# EAGLE design phi-brain4ch-ctrl (EAGLE 7.3.0)
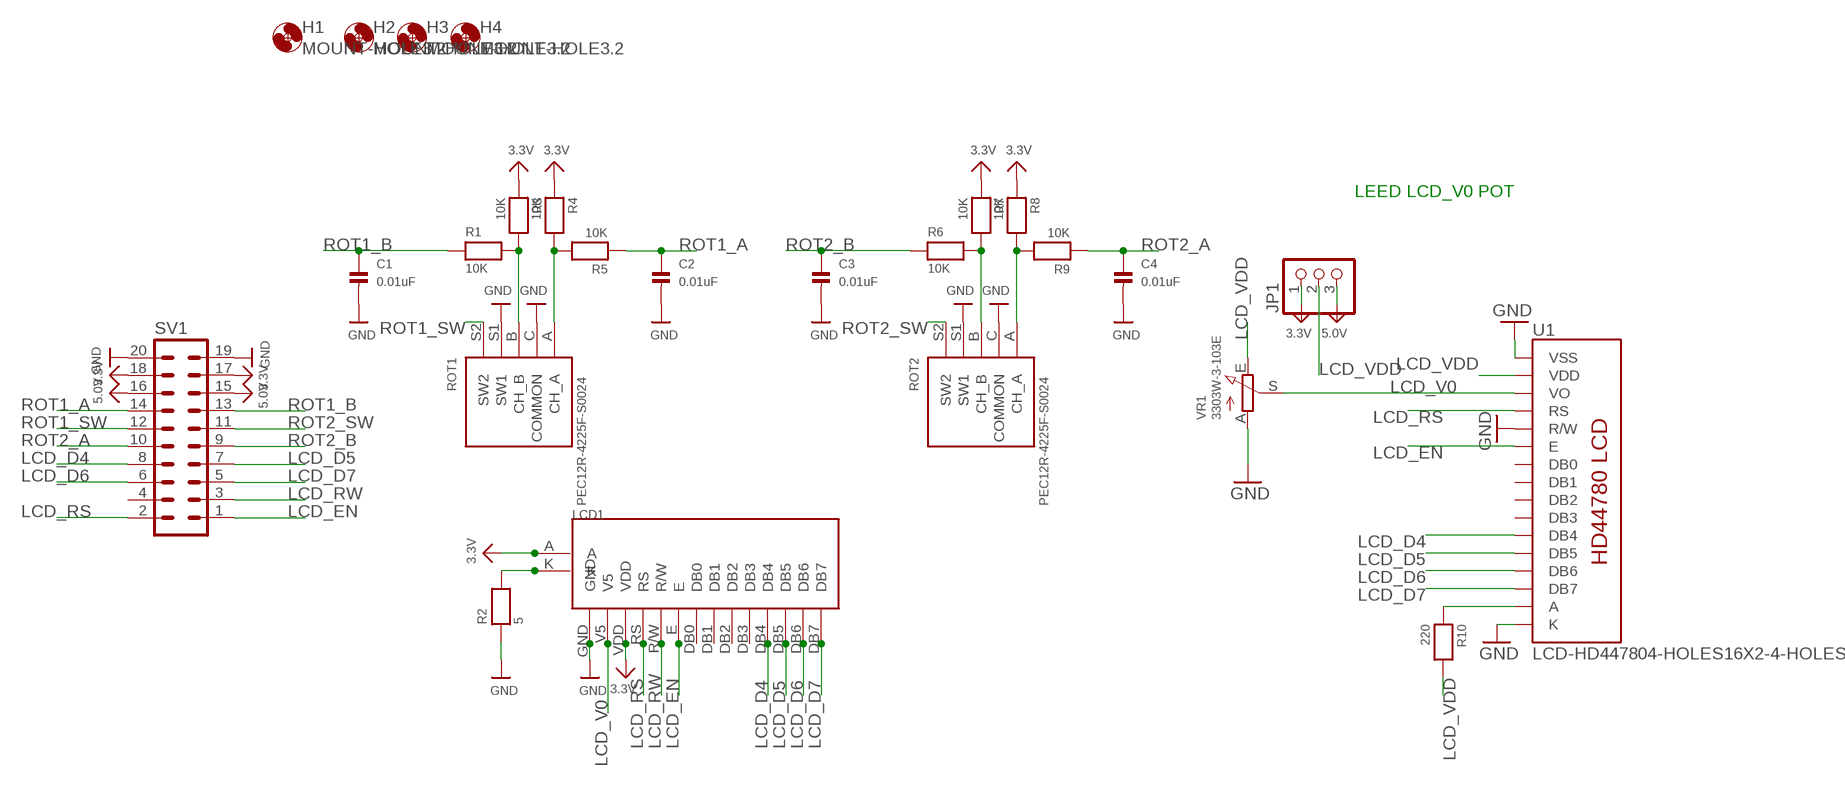
[diagram p0: schematic, sheet 1]

## Parts
C1  0.01uF  CAP_CERAMIC0805  [0805]
C2  0.01uF  CAP_CERAMIC0805  [0805]
C3  0.01uF  CAP_CERAMIC0805  [0805]
C4  0.01uF  CAP_CERAMIC0805  [0805]
H1  MOUNT-HOLE3.2  [3,2]
H2  MOUNT-HOLE3.2  [3,2]
H3  MOUNT-HOLE3.2  [3,2]
H4  MOUNT-HOLE3.2  [3,2]
JP1  PINHD-1X3  [1X03]
LCD1  NHD-C0220AA-FSW-FTW  [NHD-C0220AA-FSW-FTW]
R1  10K  RESISTOR_0805  [_0805]
R2  5  RESISTOR_0805  [_0805]
R3  10K  RESISTOR_0805  [_0805]
R4  10K  RESISTOR_0805  [_0805]
R5  10K  RESISTOR_0805  [_0805]
R6  10K  RESISTOR_0805  [_0805]
R7  10K  RESISTOR_0805  [_0805]
R8  10K  RESISTOR_0805  [_0805]
R9  10K  RESISTOR_0805  [_0805]
R10  220  RESISTOR_0805  [_0805]
ROT1  PEC12R-4225F-S0024  PEC11-4215K-S0024  [PEC111-4XXXK-SXXXX]
ROT2  PEC12R-4225F-S0024  PEC11-4215K-S0024  [PEC111-4XXXK-SXXXX]
SV1  ML203MSMT  [ML20SMT]
U1  LCD-HD447804-HOLES16X2-4-HOLES  [LCD-16X2-4HOLES]
VR1  3303W-3-103E  TRIMPOT10K_BOURNS  [TRIMPOT_BOURNS3MM]

## Nets
3.3V: JP1.1 LCD1.A LCD1.VDD R3.1 R4.1 R7.1 R8.1 SV1.17 SV1.18
5.0V: JP1.3 SV1.15 SV1.16
GND: C1.2 C2.2 C3.2 C4.2 LCD1.GND R2.1 ROT1.C(COMMON) ROT1.S1(SW1) ROT2.C(COMMON) ROT2.S1(SW1) SV1.19 SV1.20 U1.1(VSS) U1.5(R/W) U1.16(K) VR1.A
LCD_D4: LCD1.DB4 SV1.8 U1.11(DB4)
LCD_D5: LCD1.DB5 SV1.7 U1.12(DB5)
LCD_D6: LCD1.DB6 SV1.6 U1.13(DB6)
LCD_D7: LCD1.DB7 SV1.5 U1.14(DB7)
LCD_EN: LCD1.E SV1.1 U1.6(E)
LCD_RS: LCD1.RS SV1.2 U1.4(RS)
LCD_RW: LCD1.R/W SV1.3
LCD_V0: LCD1.V5 U1.3(VO) VR1.S
LCD_VDD: JP1.2 R10.2 U1.2(VDD) VR1.E
N$1: LCD1.K R2.2
N$6: R10.1 U1.15(A)
N$10: R6.2 R7.2 ROT2.B(CH_B)
N$11: R8.2 R9.2 ROT2.A(CH_A)
N$14: R1.2 R3.2 ROT1.B(CH_B)
N$15: R4.2 R5.2 ROT1.A(CH_A)
ROT1_A: C2.1 R5.1 SV1.14
ROT1_B: C1.1 R1.1 SV1.13
ROT1_SW: ROT1.S2(SW2) SV1.12
ROT2_A: C4.1 R9.1 SV1.10
ROT2_B: C3.1 R6.1 SV1.9
ROT2_SW: ROT2.S2(SW2) SV1.11
Unconnected: LCD1.DB0 LCD1.DB1 LCD1.DB2 LCD1.DB3 SV1.4 U1.7(DB0) U1.8(DB1) U1.9(DB2) U1.10(DB3)

## Notes on the sheet
- LEED LCD_V0 POT

## Library data of the parts
C1-C4 = microbuilder:CAP_CERAMIC: Ceramic Capacitors 0402 - 0402 Surface Mount Capacitors 16pF 50V 5% [Digikey: 445-4899-2-ND] 18pF 50V 5% [Digikey: 490-1281-2-ND] 22pF 50V 5% [Digikey: 490-1283-2-ND] 68pF 50V 5% [Digikey: 490-1289-2-ND] 0.1uF 10V 10% [Digikey: 490-1318-2-ND] 1.0uF 6.3V 10% [Digikey: 490-1320-2-ND] 0603 - 0603 Surface Mount Capacitors 16 pF 50V 5% [Digikey: 445-5051-2-ND] 22 pF 50V [Digikey: PCC220ACVTR-ND] 33 pF 50V 5% [Digikey: 490-1415-1-ND] 56pF 50V 5% [Digikey: 490-1421-1-ND] 220pF 50V 5% [Digikey: 445-1285-1-ND] 680 pF 50V 2200 pF 50V 5% C0G [Digikey: 445-1297-1-ND] 5600 pF 100V 5% X7R [Digikey: 478-3711-1-ND] 0.1 µF 25V 10% [Digikey: PCC2277TR-ND] 0.22 µF 16V 10% X7R [Digikey: 445-1318-1-ND] 1.0 µF 25V 10% [Digikey: 445-5146-2-ND] 0603 - RF Specific 3pF 250V +/-0.1pF RF [Digikey: 712-1347-1-ND] 18 pF 250V 5% [Digikey: 478-3505-1-ND or 712-1322-1-ND] 56 pF 250V 5% C0G RF [Digikey: 490-4867-1-ND] 68 pF 250V RF [Digikey: 490-4868-1-ND] 0805 - 0805 Surface Mount Capacitors 220 pF 250V 2% RF Ceramic Capacitor [Digikey: 712-1398-1-ND] 1000 pF 50V 2% NP0 Ceramic Capacitor [Digikey: 478-3760-1-ND] 0.1 µF 25V 10% Ceramic Capacitor [Digikey: PCC1828TR-ND] 1.0 µF 16V 10% Ceramic Capacitor[Digikey: 490-1691-2-ND] 10.0 µF 10V 10% Ceramic Capacitor[Digikey: 709-1228-1-ND] 10.0 uF 16V 10% Ceramic Capacitor [Digikey: 478-5165-2-ND] 47 uF 6.3V 20% Ceramic Capacitor [Digikey: 587-1779-1-ND or 399-5506-1-ND] 1206 - 1206 Surface Mount Capacitors 47uF 10V 20% Ceramic Capacitor [Digikey: 490-5528-1-ND or 399-5508-1-ND or 445-6010-1-ND] 100uF 6.3V -20%, +80% Y5V Ceramic Capacitor (Digikey: 490-4512-1-ND, Mouser: 81-GRM31CF50J107ZE1L)
H1-H4 = holes:MOUNT-HOLE: MOUNTING HOLE with drill center marker; POPULATE: 0
JP1 = pinhead+:PINHD-1X3: PIN HEADER
LCD1 = NHD-C0220AA-FSW-FTW:NHD-C0220AA-FSW-FTW: NHD-C0220AA-FSW-FTW http://www.newhavendisplay.com/specs/NHD-C0220AA-FSW-FTW.pdf COG (Chip-on-Glass) Liquid Crystal Display Module NHD Newhaven Display C0220 COG, 2 lines x 20 characters AA Model F Transflective SW Side White LED backlight F FSTN+ T 12:00 View Angle W Wide Temp (‐20°C ~ +70°C) RoHS Compliant www.newhavendisplay.com
R1-R10 = microbuilder:RESISTOR: Resistors 0402 - 0402 Surface Mount Package 22 Ohm 1% 1/16W [Digikey: 311-22.0LRTR-ND] 33 Ohm 5% 1/16W 1.0K 5% 1/16W 1.5K 5% 1/16W 2.0K 1% 1/16W 10.0K 1% 1/16W [Digikey: 311-10.0KLRTR-ND] 10.0K 5% 1/16W [Digikey: RMCF0402JT10K0TR-ND] 12.1K 1% 1/16W [Digikey: 311-22.0LRTR-ND] 100.0K 5% 1/16W 0603 - 0603 Surface Mount Package 0 Ohm 1/10 Watt 1% Resistor 15 Ohm 1/10 Watt 1% Resistor 33 Ohm 1/10 Watt 1% Resistor 49.9 Ohm 1/10 Watt 1% Resistor 100 Ohm 1/10 Watt 1% Resistor 150 Ohm 1/10 Watt 1% Resistor 240 Ohm 1/10 Watt 1% Resistor 390 Ohm 1/10 Watt 1% Resistor 560 Ohm 1/10 Watt 1% Resistor 680 Ohm 1/10 Watt 1% Resistor 750 Ohm 1/10 Watt 1% Resistor 1.0K Ohm 1/10 Watt 1% Resistor 1.5K Ohm 1/10 Watt 1% Resistor 2.0K Ohm 1/10 Watt 1% Resistor 2.2K Ohm 1/10 Watt 1% Resistor 3.3K Ohm 1/10 Watt 1% Resistor 4.7K Ohm 1/10 Watt 1% Resistor 10.0K Ohm 1/10 Watt 1% Resistor 12.0K Ohm 1/10 Watt 1% Resistor 12.1K Ohm 1/10 Watt 1% Resistor 20.0K Ohm 1/10 Watt 1% Resistor 33.0K Ohm 1/10 Watt 1% Resistor 100.0K Ohm 1/10 Watt 1% Resistor 0805 - 0805 Surface Mount Package 0 Ohm 1/8 Watt 1% Resistor 33 Ohm 1/8 Watt 1% Resistor 100 Ohm 1/8 Watt 1% Resistor 150 Ohm 1/8 Watt 1% Resistor 200 Ohm 1/8 Watt 1% Resistor 240 Ohm 1/8 Watt 1% Resistor 330 Ohm 1/8 Watt 1% Resistor 390 Ohm 1/8 Watt 1% Resistor 470 Ohm 1/8 Watt 1% Resistor 1.0K Ohm 1/8 Watt 1% Resistor 1.5K Ohm 1/8 Watt 1% Resistor 2.0K Ohm 1/8 Watt 1% Resistor 4.7K Ohm 1/8 Watt 1% Resistor 5.1K Ohm 1/8 Watt 1% Resistor 5.6K Ohm 1/8 Watt 1% Resistor 10.0K Ohm 1/8 Watt 1% Resistor 22.0K Ohm 1/8 Watt 1% Resistor 33.0K Ohm 1/8 Watt 1% Resistor 100K Ohm 1/8 Watt 1% Resistor 1206 - 1206 Surface Mount Package 2012 - 2010 Surface Mount Package 0.11 Ohm 1/2 Watt 1% Resistor - Digikey: RHM.11UCT-ND
ROT1 ROT2 = keves:PEC11-4215K-S0024
SV1 = keves:ML20: HARTING; PARTNO: D2520-6V0C-AR-WE
U1 = HD44780LCD:LCD-HD44780
VR1 = microbuilder:TRIMPOT: Potentiometers 3mm 10K Single Turn - Digikey: 3303W-103ETR-ND 3mm 100K Single Turn - Digikey: 3303X-104ETR-ND

## Net classes
0 default: width 0.406 mm

## Board
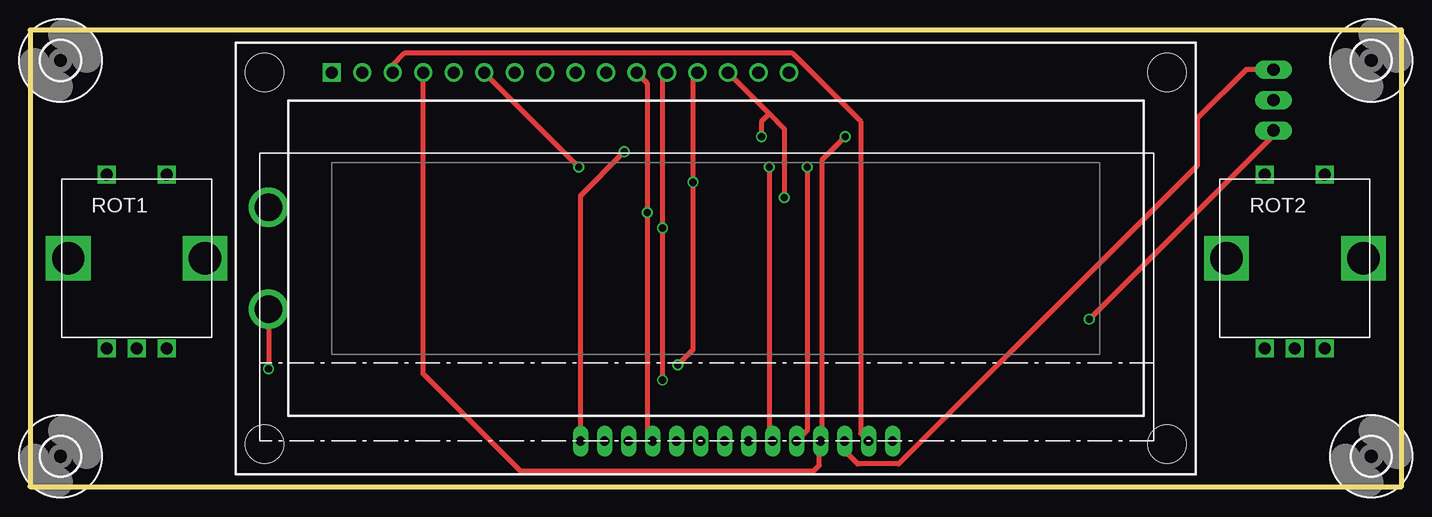
[diagram p1: board, top side]
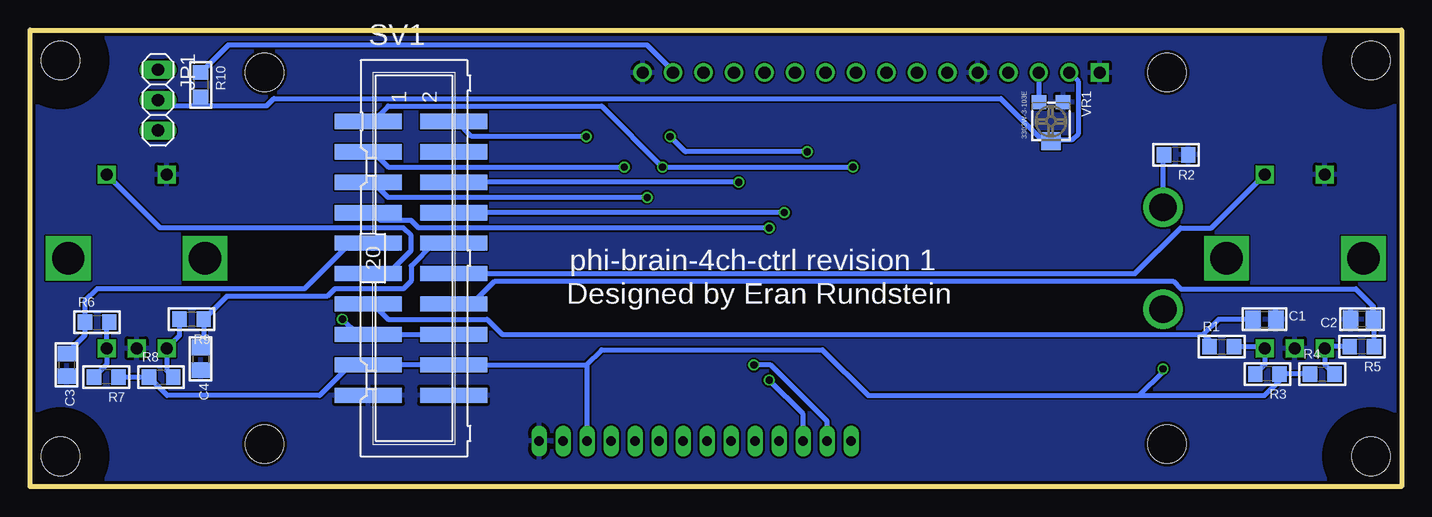
[diagram p2: board, bottom side, seen from below]

Size 114.3 x 38.1 mm. Coordinates in mm from the lower left corner, seen from the top.
Outline: 0,0 114.3,0 114.3,38.1 0,38.1 0,0
Copper layers (1*16): Top 0.035mm / dielectric 1.5mm / Bottom 0.035mm
Design rules "SeeedStudio_2layer_DRU_no_angle_20140221": minimum track width 6mil, minimum drill 12mil, track to track 6mil, track to pad 6mil, pad to pad 6mil, via to via 6mil, smd to smd 0mil, copper to edge 10mil, drill to drill 10mil, minimum pad ring 10mil, minimum via ring 6mil, stop-mask expansion 2mil, vias tented up to drill 100mil, thermal gap 10mil

### Footprints (pad centres in the part's own frame; a part is rotated, then mirrored left to right if it is on the bottom)
0805 = smd 1.3 x 1.5: 1 -0.95,0; 2 0.95,0
3,2 = hole 3.2: 0,0
1X03 = drill 1.016 long: 1 -2.54,0; 2 0,0; 3 2.54,0
NHD-C0220AA-FSW-FTW = drill 2.3: A -4.25,11; K -4.25,19.5 | drill 0.8 long: DB0 35.75,0; DB1 33.75,0; DB2 31.75,0; DB3 29.75,0; DB4 27.75,0; DB5 25.75,0; DB6 23.75,0; DB7 21.75,0; E 37.75,0; GND 47.75,0; R/W 39.75,0; RS 41.75,0; V5 45.75,0; VDD 43.75,0
_0805 = smd 1.2 x 1.3: 1 -1.016,0; 2 1.016,0
PEC111-4XXXK-SXXXX = drill 1 square: A -2.5,-7.5; B 2.5,-7.5; C 0,-7.5; S1 -2.5,7; S2 2.5,7 | drill 2.7 square: P$1 -5.7,0; P$2 5.7,0
ML20SMT = smd 1.27 x 5.588: 1 -11.43,-3.81; 2 -11.43,3.302; 3 -8.89,-3.81; 4 -8.89,3.302; 5 -6.35,-3.81; 6 -6.35,3.302; 7 -3.81,-3.81; 8 -3.81,3.302; 9 -1.27,-3.81; 10 -1.27,3.302; 11 1.27,-3.81; 12 1.27,3.302; 13 3.81,-3.81; 14 3.81,3.302; 15 6.35,-3.81; 16 6.35,3.302; 17 8.89,-3.81; 18 8.89,3.302; 19 11.43,-3.81; 20 11.43,3.302
LCD-16X2-4HOLES = drill 1.016 square: 1 -32,15.5 | drill 1.016: 2 -29.46,15.5; 3 -26.92,15.5; 4 -24.38,15.5; 5 -21.84,15.5; 6 -19.3,15.5; 7 -16.76,15.5; 8 -14.22,15.5; 9 -11.68,15.5; 10 -9.14,15.5; 11 -6.6,15.5; 12 -4.06,15.5; 13 -1.52,15.5; 14 1.02,15.5; 15 3.56,15.5; 16 6.1,15.5 | hole 3.2: -37.6,15.5; -37.6,-15.5; 37.6,-15.5; 37.6,15.5
TRIMPOT_BOURNS3MM = smd 1.2 x 1.2: A -1,-1.6; S 1,-1.6 | smd 1.6 x 1.5: E 0,1.65

### Placement (x,y rotation side)
C1  11.43,13.97 0 bottom
C2  3.3,13.97 180 bottom
C3  111.25,10.16 270 bottom
C4  100.08,10.67 270 bottom
H1  111.76,2.54 0 top
H2  111.76,35.56 0 top
H3  2.54,2.54 0 top
H4  2.54,35.56 0 top
JP1  103.63,32.26 270 bottom
LCD1  24.13,3.81 0 top
R1  14.99,11.68 0 bottom
R2  18.8,27.69 180 bottom
R3  11.18,9.4 180 bottom
R4  6.6,9.4 0 bottom
R5  3.3,11.68 180 bottom
R6  108.71,13.72 0 bottom
R7  107.95,9.14 180 bottom
R8  103.38,9.14 0 bottom
R9  100.84,13.97 180 bottom
R10  750  [_0805]  100.08,33.53 270 bottom
ROT1  8.89,19.05 0 top
ROT2  105.41,19.05 0 top
SV1  82.3,19.05 270 bottom
U1  57.15,19.05 0 top
VR1  29.21,30.48 180 bottom

### Tracks (layer width: path | path; a pad name or v marks a point on that pad's centre or on a via)
3.3V  (via drill 0.6)
  Top 0.406: LCD1.A v19.88,9.84 | JP1.1 101.35,34.8 97.28,30.73 97.28,26.8 72.39,1.91 68.96,1.91 67.88,2.99 LCD1.VDD
  Bottom 0.406: R4.1 R3.1 10.16,8.89 11.43,7.62 21.84,7.62 | R7.1 R8.1 102.87,7.62 90.17,7.62 87.63,10.16 SV1.17 SV1.18 67.94,10.16 | 21.84,7.62 44.45,7.62 48.26,11.43 66.67,11.43 67.94,10.16 | v19.88,9.84 19.88,9.58 21.84,7.62 | LCD1.VDD 67.88,10.1 67.94,10.16
5.0V  (via drill 0.6)
  Top 0.406: v88.27,13.97 103.63,29.34 JP1.3
  Bottom 0.406: v88.27,13.97 87,12.7 SV1.15 SV1.16
GND
  pour Bottom: -4.06,43.69 117.6,43.69 117.6,-5.33 -4.32,-5.33 -4.32,43.69
LCD_D4  (via drill 0.6)
  Top 0.406: LCD1.DB4 51.44,3.81 v51.44,22.86 51.44,33.66 U1.11
  Bottom 0.406: v51.44,22.86 SV1.8
LCD_D5  (via drill 0.6)
  Top 0.406: v52.7,8.89 v52.7,21.59 52.7,34.16 U1.12
  Bottom 0.406: v52.7,21.59 81.92,21.59 82.55,22.23 85.09,22.23 85.72,22.86 SV1.7 | LCD1.DB5 49.88,6.07 v52.7,8.89
LCD_D6  (via drill 0.6)
  Top 0.406: v53.98,10.16 55.24,11.43 v55.24,25.4 55.24,34.16 U1.13
  Bottom 0.406: v55.24,25.4 SV1.6 | LCD1.DB6 47.88,5.46 52.58,10.16 v53.98,10.16
LCD_D7  (via drill 0.6)
  Top 0.406: v62.87,24.13 62.87,29.84 61.59,31.11 | 61.59,31.11 58.93,33.78 58.93,33.79 U1.14 | LCD1.DB7 45.88,24.29 v49.53,27.94 | v60.96,29.21 60.96,30.48 61.59,31.11
  Bottom 0.406: v62.87,24.13 84.45,24.13 85.72,25.4 SV1.5 | v49.53,27.94 59.69,27.94 v60.96,29.21
LCD_EN  (via drill 0.6)
  Top 0.406: v61.59,26.67 61.59,4.09 LCD1.E | v45.72,26.67 38.1,34.29 38.1,34.3 U1.6
  Bottom 0.406: SV1.1 85.72,30.48 84.45,31.75 66.67,31.75 v61.59,26.67 v45.72,26.67
LCD_RS  (via drill 0.6)
  Top 0.406: v67.94,29.21 66.04,27.3 66.04,3.97 LCD1.RS 65.79,3.72 65.79,1.78 65.28,1.27 40.89,1.27 32.77,9.4 U1.4
  Bottom 0.406: v67.94,29.21 77.47,29.21 78.74,30.48 SV1.2
LCD_RW  (via drill 0.6)
  Top 0.406: v64.77,26.67 64.77,4.7 LCD1.R/W
  Bottom 0.406: v64.77,26.67 84.45,26.67 85.72,27.94 SV1.3
LCD_V0
  Top 0.406: LCD1.V5 69.85,3.81 69.22,4.45 69.22,30.48 63.5,36.2 31.24,36.2 30.23,35.18 U1.3
  Bottom 0.406: U1.3 30.23,32.1 VR1.S
LCD_VDD
  Bottom 0.406: 29.34,28.96 29.97,28.96 33.4,32.38 93.98,32.38 94.61,31.75 100.08,31.75 | 29.34,28.96 VR1.E | 29.34,28.96 27.43,28.96 26.92,29.46 26.92,33.78 U1.2 | 100.08,31.75 103.12,31.75 JP1.2 | R10.2 100.08,31.75
N$1
  Bottom 0.406: LCD1.K 19.88,27.62 R2.2
N$6
  Bottom 0.406: R10.1 97.79,36.83 62.87,36.83 60.71,34.67 U1.15
N$10
  Bottom 0.406: R7.2 107.91,10.2 ROT2.B 107.91,13.5 R6.2
N$11
  Bottom 0.406: R8.2 102.91,9.69 ROT2.A 101.85,12.61 R9.2
N$14
  Bottom 0.406: R3.2 11.39,10.2 ROT1.B 11.52,11.68 R1.2
N$15
  Bottom 0.406: R4.2 6.39,10.2 ROT1.A 6.26,11.68 R5.2
ROT1_A
  Bottom 0.406: SV1.14 77.47,15.24 75.56,17.14 19.05,17.14 18.41,16.51 3.81,16.51 2.35,15.05 C2.1 2.29,13.9 R5.1
ROT1_B
  Bottom 0.406: 16.51,12.7 74.93,12.7 76.2,13.97 84.45,13.97 85.72,15.24 SV1.13 | R1.1 16,12.19 16.51,12.7 | C1.1 15.24,13.97 16.51,12.7
ROT1_SW
  Bottom 0.406: SV1.12 22.23,17.78 18.41,21.59 15.85,21.59 ROT1.S2
ROT2_A
  Bottom 0.406: SV1.10 80.64,20.32 82.55,18.41 82.55,17.14 83.19,16.51 88.9,16.51 89.53,15.88 97.92,15.88 R9.1 99.82,11.87 C4.1
ROT2_B
  Bottom 0.406: C3.1 109.73,12.63 R6.1 109.73,15.49 108.71,16.51 91.44,16.51 87.63,20.32 SV1.9
ROT2_SW
  Bottom 0.406: SV1.11 84.45,17.78 82.55,19.68 82.55,20.95 83.19,21.59 103.45,21.59 ROT2.S2

### Text on the board
bPlace: phi-brain-4ch-ctrl revision 1 | Designed by Eran Rundstein